# EasyEDA Pro project Simple打印机-V10.eprj

# Schematic Schematic4_6
Create Date: 2023-04-25; Page Name: P1; Project Name: Mini打印机-V8; Schematic Name: Schematic4_6; Update Date: 2023-09-03; Company: 嘉立创EDA; Page Size: A2; Version: V1.0
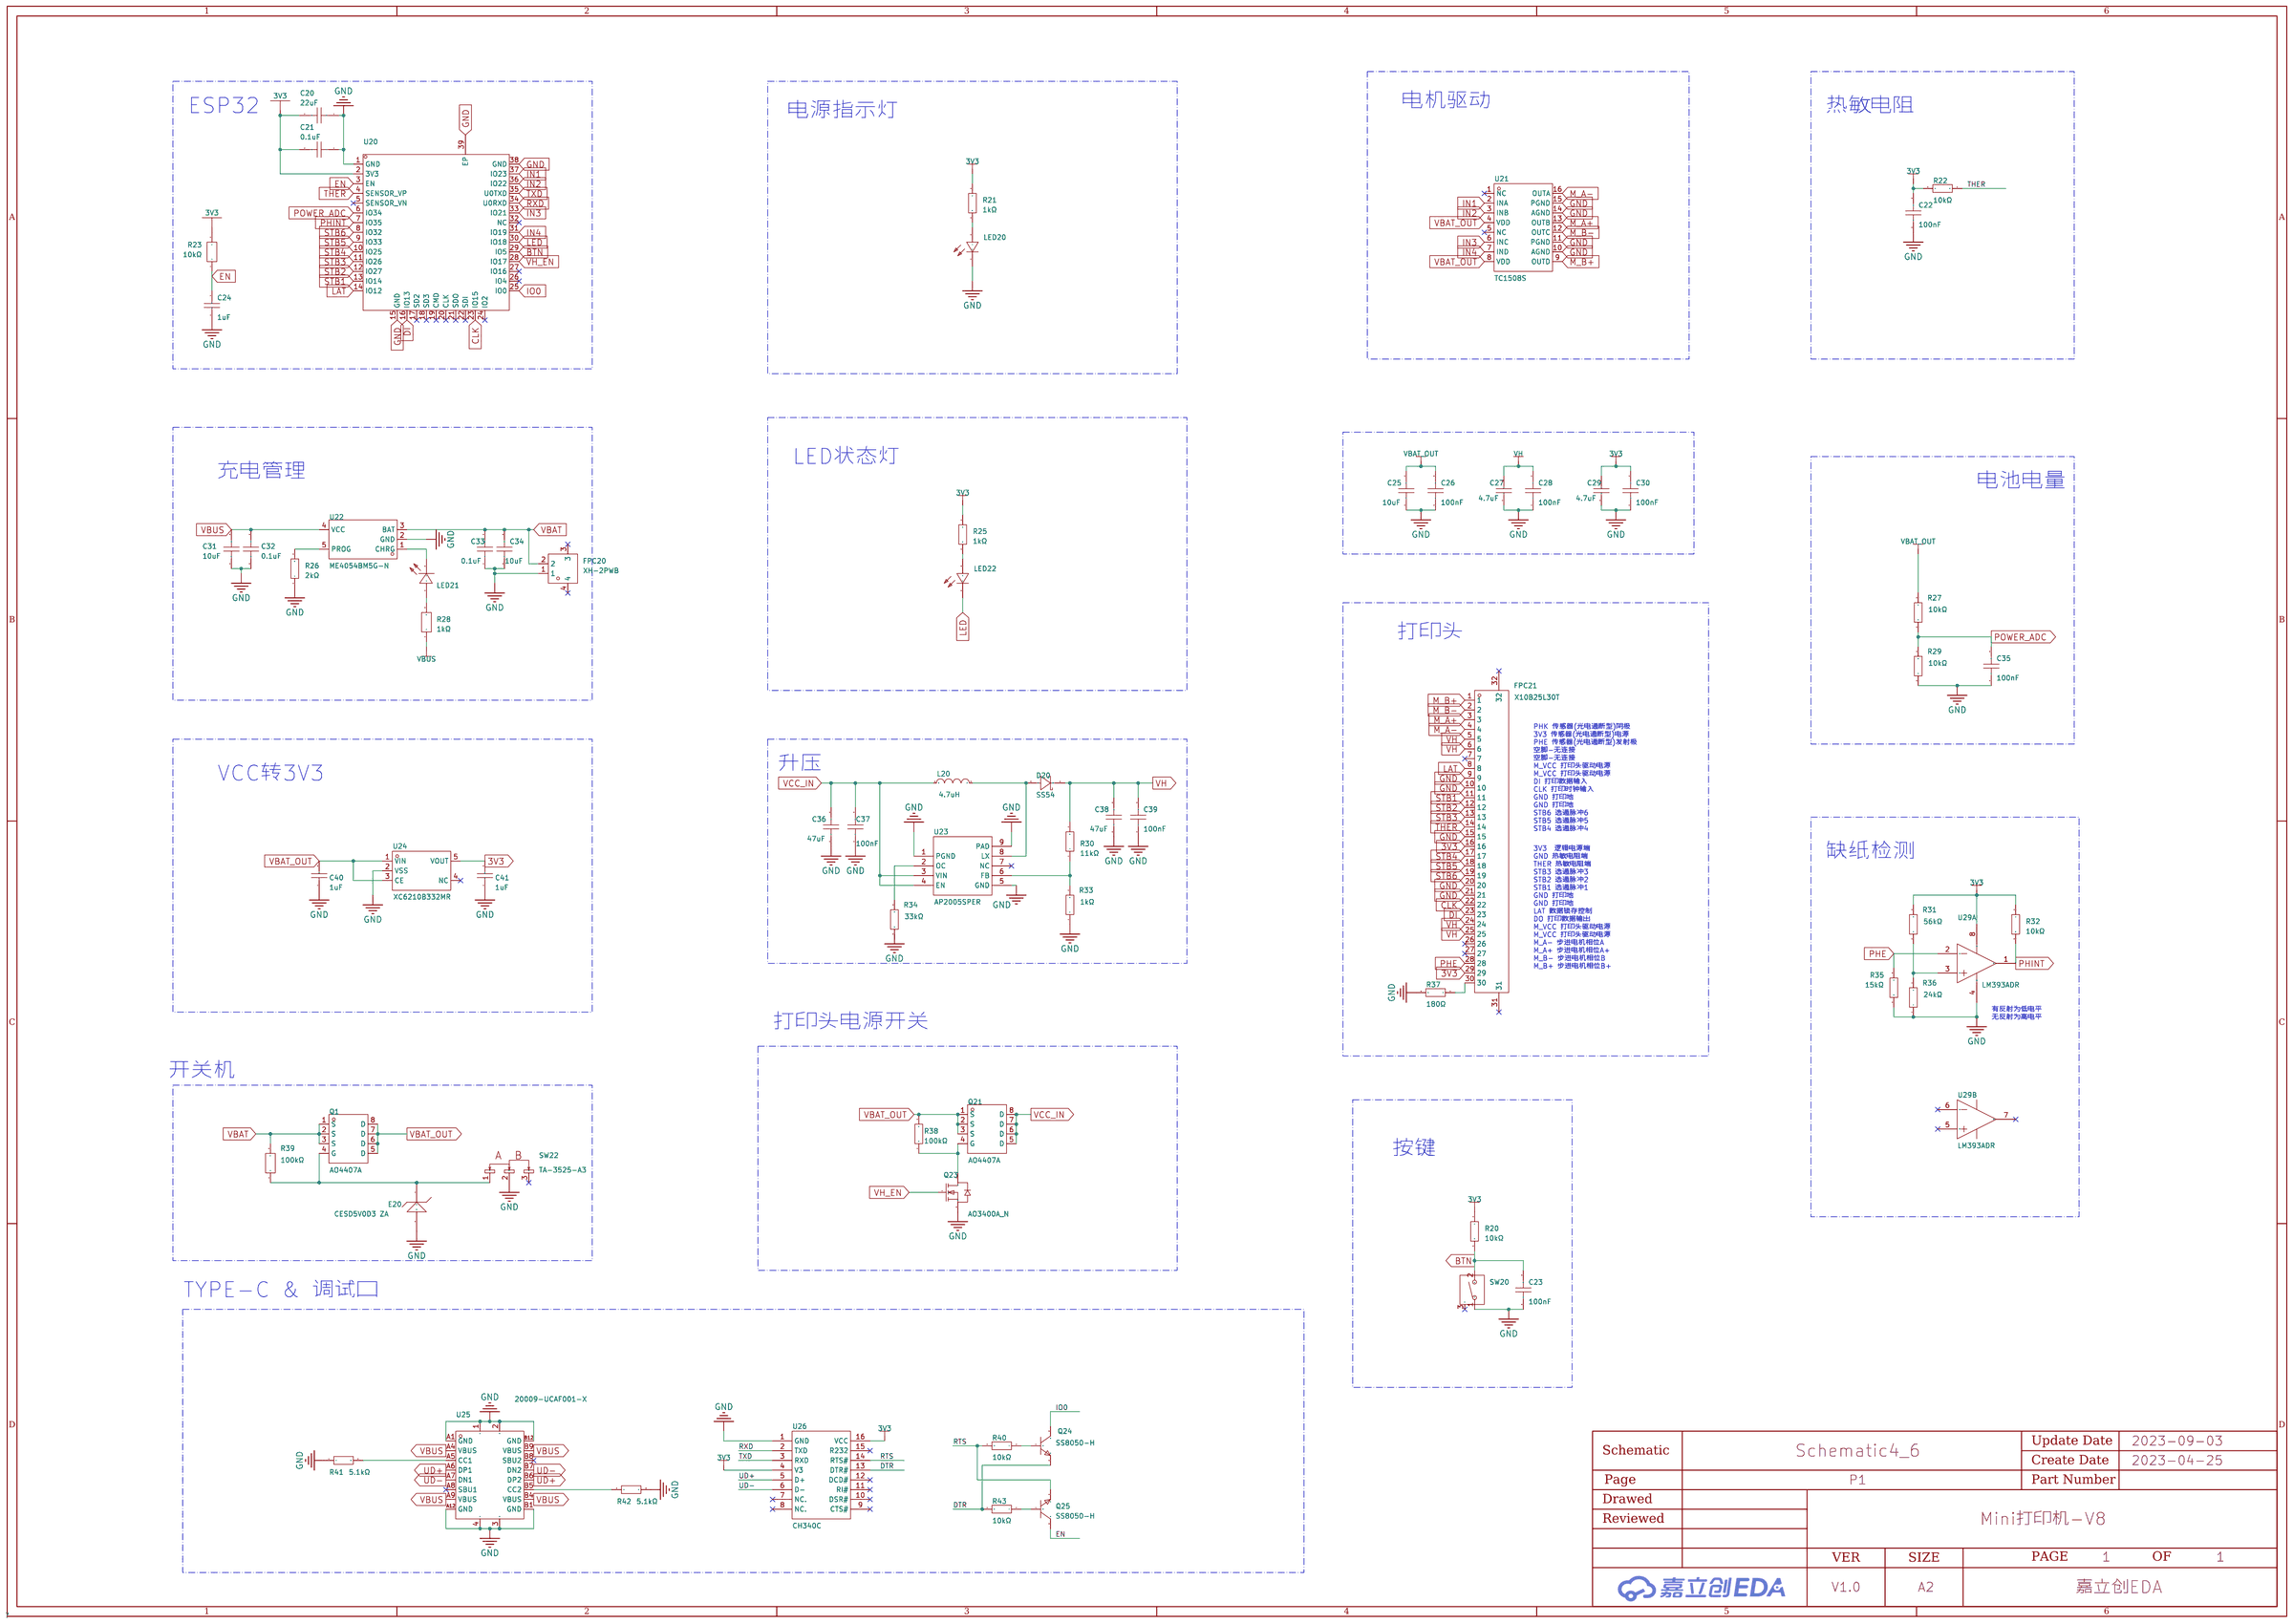
[diagram p0: schematic sheet]

## Parts
C20  22uF  [c0603]
C21  0.1uF  [c0603]
C22  100nF  [C0603]
C23  100nF  [C0603]
C24  1uF  [C0603]
C25  10uF  [C0603]
C26  100nF  [C0603]
C27  4.7uF  [C0603]
C28  100nF  [C0603]
C29  4.7uF  [C0603]
C30  100nF  [C0603]
C31  10uF  [C0603]
C32  0.1uF  [c0603]
C33  0.1uF  [c0603]
C34  10uF  [C0603]
C35  100nF  [C0603]
C36  47uF  [C1206]
C37  100nF  [C0603]
C38  47uF  [C1206]
C39  100nF  [C0603]
C40  1uF  [C0603]
C41  1uF  [C0603]
D20  SS54  [SMA_L4.3-W2.6-LS5.0-RD]
E20  CESD5V0D3 ZA  [SOD-323_L1.8-W1.3-LS2.5-RD]
FPC20  XH-2PWB  [CONN-SMD_2P-P2.50_DEALON_XH-2PWB_C2905024]
FPC21  X10B25L30T  [FPC-SMD_X10B25U30T]
L20  4.7uH  [IND-SMD_L6.0-W6.0]
LED20  NCD0603R1  [LED0603-RD_RED]
LED21  TLMG1100-GS08  [LED0603-R-RD_GREEN]
LED22  NCD0603R1  [LED0603-RD_RED]
Q1  AO4407A  [SOP-8_L5.0-W4.0-P1.27-LS6.0-BL]
Q21  AO4407A  [SOP-8_L5.0-W4.0-P1.27-LS6.0-BL]
Q23  AO3400A_N  [SOT-23-3_L2.9-W1.3-P1.90-LS2.4-BR]
Q24  SS8050-H  [SOT-23-3_L2.9-W1.3-P1.90-LS2.4-BR]
Q25  SS8050-H  [SOT-23-3_L2.9-W1.3-P1.90-LS2.4-BR]
R20  10kΩ  [R0603]
R21  1kΩ  [R0603]
R22  10kΩ  [R0603]
R23  10kΩ  [r0603]
R25  1kΩ  [R0603]
R26  2kΩ  [R0603]
R27  10kΩ  [R0603]
R28  1kΩ  [R0603]
R29  10kΩ  [R0603]
R30  11kΩ  [R0603]
R31  56kΩ  [R0603]
R32  10kΩ  [R0603]
R33  1kΩ  [R0603]
R34  33kΩ  [R0603]
R35  15kΩ  [R0603]
R36  24kΩ  [R0603]
R37  180Ω  [R0603]
R38  100kΩ  [R0603]
R39  100kΩ  [R0603]
R40  10kΩ  [R0603]
R41  5.1kΩ  [R0603]
R42  5.1kΩ  [R0603]
R43  10kΩ  [R0603]
SW20  TS4538B3JTP 250gf 121  [KEY-SMD_3P-L4.5-W3.8-P3.00-LS4.5-BL]
SW22  TA-3525-A3  [SW-SMD_3P-L9.1-W3.5-P2.50-EH6.8]
U20  -  [wirelm-smd_esp32-s]
U21  TC1508S  [SOP-16_L10.0-W3.9-P1.27-LS6.0-BL]
U22  ME4054BM5G-N  [TSOT-23-5_L2.9-W1.6-P0.95-LS2.8-BL]
U23  AP2005SPER  [ESOP-8_L4.9-W3.9-P1.27-LS6.0-BL-EP]
U24  XC6210B332MR  [TSOT-23-5_L2.9-W1.6-P0.95-LS2.8-BR]
U25  20009-UCAF001-X  [TYPE-C-SMD_20009-UCAF001-X]
U26  CH340C  [SOP-16_L10.0-W3.9-P1.27-LS6.0-BL]
U29  LM393ADR  [SOP-8_L4.9-W3.9-P1.27-LS6.0-BL]  (sections 1,2)

## Library data of the parts
C20 = mt18n1r5c500ct: 容值:22uF;精度:±0.25pF;额定电压:50V;温度系数:NP0;; LCSC Part Name: 22uF 25V; Supplier Part: C96446; Manufacturer: 华新科(Walsin); Manufacturer Part: MT18N1R5C500CT; Supplier Footprint: 0603; JLCPCB Part Class: Extended Part; Datasheet: https://atta.szlcsc.com/upload/public/pdf/source/20191217/C470045_C8EA1FED8E7D9FF06975A0CE3DEB0325.pdf; Supplier: LCSC; Tolerance: ±0.25pF; Voltage Rated: 50V; Temperature Coefficient: NP0
C21 C32 C33 = mt18n1r5c500ct: 容值：100nF 精度：±10% 额定电压：50V 材质(温度系数)：X7R 材质:X7R; LCSC Part Name: 100nF; Supplier Part: C14663; Manufacturer: 华新科(Walsin); Manufacturer Part: MT18N1R5C500CT; Supplier Footprint: 0603; JLCPCB Part Class: Extended Part; Datasheet: https://atta.szlcsc.com/upload/public/pdf/source/20191217/C470045_C8EA1FED8E7D9FF06975A0CE3DEB0325.pdf; Supplier: LCSC; Tolerance: ±0.25pF; Voltage Rated: 50V; Temperature Coefficient: NP0
C22 C23 C26 C28 C30 C35 C37 C39 = CL10B104KB8NNNC: 容值:100nF;精度:±10%;额定电压:50V;材质(温度系数):X7R;; LCSC Part Name: 100nF ±10% 50V; Supplier Part: C1591; Manufacturer: SAMSUNG(三星); Supplier Footprint: 0603; JLCPCB Part Class: 扩展库; Datasheet: https://atta.szlcsc.com/upload/public/pdf/source/20160103/1457707680512.pdf; Supplier: LCSC; Tolerance: ±10%; Voltage Rated: 50V; Temperature Coefficient: X7R
C24 C40 C41 = CL10A105KB8NNNC: 容值:1uF;精度:±10%;额定电压:50V;材质(温度系数):X5R;; LCSC Part Name: 1uF ±10% 50V; Supplier Part: C15849; Manufacturer: SAMSUNG(三星); Supplier Footprint: 0603; JLCPCB Part Class: 基础库; Datasheet: https://atta.szlcsc.com/upload/public/pdf/source/20160103/1457707679084.pdf; Supplier: LCSC; Tolerance: ±10%; Voltage Rated: 50V; Temperature Coefficient: X5R
C25 C31 C34 = CL10A106MA8NRNC: 容值:10uF;精度:±20%;额定电压:25V;材质(温度系数):X5R;; LCSC Part Name: 10uF ±20% 25V; Supplier Part: C96446; Manufacturer: SAMSUNG(三星); Supplier Footprint: 0603; JLCPCB Part Class: 基础库; Datasheet: https://atta.szlcsc.com/upload/public/pdf/source/20170325/1490427913016.pdf; Supplier: LCSC; Tolerance: ±20%; Voltage Rated: 25V; Temperature Coefficient: X5R
C27 C29 = CL10A475KA8NQNC: 容值:4.7uF;精度:±10%;额定电压:25V;材质(温度系数):X5R;; LCSC Part Name: 4.7uF ±10% 25V; Supplier Part: C69335; Manufacturer: SAMSUNG(三星); Supplier Footprint: 0603; JLCPCB Part Class: 扩展库; Datasheet: https://atta.szlcsc.com/upload/public/pdf/source/20161108/1478586410580.pdf; Supplier: LCSC; Tolerance: ±10%; Voltage Rated: 25V; Temperature Coefficient: X5R
C36 C38 = CL31A476MPHNNNE: 容值:47uF;精度:±20%;额定电压:10V;材质(温度系数):X5R;; LCSC Part Name: 47uF ±20% 10V; Supplier Part: C96123; Manufacturer: SAMSUNG(三星); Supplier Footprint: 1206; JLCPCB Part Class: 基础库; Datasheet: https://atta.szlcsc.com/upload/public/pdf/source/20170228/1488267692219.pdf; Supplier: LCSC; Tolerance: ±20%; Voltage Rated: 10V; Temperature Coefficient: X5R
D20 = SS54_C727065: 二极管配置:独立式;直流反向耐压(Vr):40V;平均整流电流(Io):5A;正向压降(Vf):550mV@5A;反向电流(Ir):500uA@40V;; LCSC Part Name: 40V 5A 550mV@5A; Supplier Part: C727065; Manufacturer: TWGMC(台湾迪嘉); Supplier Footprint: SMA; JLCPCB Part Class: 扩展库; Datasheet: https://atta.szlcsc.com/upload/public/pdf/source/20200828/C727064_BD0A2B36CBC76CEA4B6710C57718D41F.pdf; Supplier: LCSC; Diode Configuration: 独立式; Reverse Voltage (Vr): 40V; Average Rectified Current (Io): 5A; Forward Voltage (Vf@If): 550mV@5A; Reverse Leakage Current (Ir): 500uA@40V
E20 = CESD5V0D3 ZA: 极性:单向;反向截止电压(Vrwm):5V;击穿电压(VBR):6.2V;峰值脉冲电流(Ipp)@8/20us:15A;钳位电压(Vc)@Ipp:15.5V;; LCSC Part Name: CESD5V0D3  ZA; Supplier Part: C22643; Manufacturer: CJ(江苏长电/长晶); Supplier Footprint: SOD-323; JLCPCB Part Class: 扩展库; Datasheet: https://atta.szlcsc.com/upload/public/pdf/source/20140301/1457707004115.pdf; Supplier: LCSC; Polarity: 单向; Reverse Stand-Off Voltage (Vrwm): 5V; Breakdown Voltage (VBR): 6.2V; Peak Pulse Current(Ipp)@8/20us: 15A; Clamping Voltage@Ipp: 15.5V
FPC20 = XH-2PWB: 参考系列:XH;间距:2.5mm;插针结构:1x2P;排数:1;每排PIN数:2;行距:-;公母:公型插针;安装方式:卧贴;额定电流:3A;工作温度范围:-25~+85;; LCSC Part Name: XH 2.5mm 1x2P 卧贴; Supplier Part: C2905024; Manufacturer: DEALON(德艺隆); Supplier Footprint: SMD,P=2.5mm; JLCPCB Part Class: 扩展库; Datasheet: https://atta.szlcsc.com/upload/public/pdf/source/20211025/6C2B75DB1AEBD099C7E95723735B67A6.pdf; Supplier: LCSC; Reference Series: XH; Pitch: 2.5mm; Pins Structure: 1x2P; Number of Rows: 1; Number of PINs Per Row: 2; Gender: 公型插针; Mounting Style: 卧贴; Current Rating (Max): 3A; Operating Temperature Range: -25~+85
FPC21 = X10B25L30T: 间距:1mm;触点数量:30;锁定特性:抽屉式;安装类型:卧贴;触点类型:下接;工作温度范围:-40~+85;焊接温度(最大值):260;; LCSC Part Name: 1mm P数:30 抽屉式 下接 镀锡; Supplier Part: C500182; Manufacturer: XKB Connectivity(中国星坤); Supplier Footprint: SMD,P=1mm; JLCPCB Part Class: 扩展库; Datasheet: https://atta.szlcsc.com/upload/public/pdf/source/20211011/C16FFC4EB876FDA360008692BDE0DBBC.pdf; Supplier: LCSC; Pitch: 1mm; Number of Contacts: 30; Locking Feature: 抽屉式; Mounting Type: 卧贴; Contact Type: 下接; Height Above Board: 2.5mm; FFC, FCB Thickness: 0.3mm; Contact Material: 磷青铜; Contact Plating: 锡; Operating Temperature Range: -40~+85; Welding Temperature (Max): 260
L20 = 1255AY-4R7M=P3: 电感值:4.7uH;精度:±20%;额定电流:4A;直流电阻(DCR):27.6mΩ;; LCSC Part Name: 4.7uH ±20% 4A 27.6mΩ; Supplier Part: C160951; Manufacturer: muRata(村田); Supplier Footprint: SMD,6x6mm; JLCPCB Part Class: 扩展库; Datasheet: https://atta.szlcsc.com/upload/public/pdf/source/20180321/1B6FF4BE0FFC72AFEACC22219DD2DCA9.pdf; Supplier: LCSC; Tolerance: ±20%; Rated Current: 4A; DC Resistance (DCR): 27.6mΩ
LED20 LED22 = NCD0603R1_C84263: 发光颜色:红灯;; LCSC Part Name: 红灯; Supplier Part: C84263; Manufacturer: 国星光电; Supplier Footprint: 0603; JLCPCB Part Class: 扩展库; Datasheet: https://atta.szlcsc.com/upload/public/pdf/source/20200820/C84263_DABC6A75E58F576973B407FDBA283D60.pdf; Supplier: LCSC; Emitted Color: 红灯
LED21 = TLMG1100-GS08: 照明颜色:普绿/黄绿;色温 - CCT（K）:-;主波长/色坐标:570nm;; LCSC Part Name: 普绿/黄绿 0603; Supplier Part: C241891; Manufacturer: VISHAY(威世); Supplier Footprint: 0603; JLCPCB Part Class: 扩展库; Datasheet: https://atta.szlcsc.com/upload/public/pdf/source/20180719/C241891_3C76D4DD30CDE57601F75DEAAAECA69D.pdf; Supplier: LCSC; Mounting Type: 表面贴装; Illumination Color: 普绿/黄绿; Luminous Intensity (IF=20mA): 35mcd; Dominant Wavelength / Coordinate rank: 570nm
Q1 Q21 = AO4407A_C2841482: 类型:-;漏源电压(Vdss):-;连续漏极电流(Id):-;功率(Pd):-;导通电阻(RDS(on)@Vgs,Id):-;阈值电压(Vgs(th)@Id):-;栅极电荷(Qg@Vgs):-;输入电容(Ciss@Vds):-;反向传输电容(Crss@Vds):-;; Supplier Part: C2841482; Manufacturer: UMW(友台半导体); Supplier Footprint: SOP-8; JLCPCB Part Class: 扩展库; Datasheet: https://atta.szlcsc.com/upload/public/pdf/source/20220926/8EBB8ABDBC276CD6D410CF8B1BF429E7.pdf; Supplier: LCSC
Q23 = AO3400A_C347475: LCSC Part Name: AO3400A; Supplier Part: C347475; Manufacturer: UMW(友台半导体); Manufacturer Part: AO3400A; Supplier Footprint: SOT-23; JLCPCB Part Class: 扩展库; Datasheet: https://atta.szlcsc.com/upload/public/pdf/source/20190827/C347475_40CAF14D9CD0153436F5DC917B39143D.pdf; Supplier: LCSC
Q24 Q25 = SS8050-H: 晶体管类型:NPN;集射极击穿电压(Vceo):25V;集电极电流(Ic):1.5A;功率(Pd):300mW;集电极截止电流(Icbo):100nA;集电极-发射极饱和电压(VCE(sat)@Ic,Ib):500mV@800mA,80mA;直流电流增益(hFE@Ic,Vce):200@100mA,1V;特征频率(fT):100MHz;工作温度:-55~+150@(Tj);; LCSC Part Name: NPN 25V 1.5A; Supplier Part: C699255; Manufacturer: YANGJIE(扬杰); Supplier Footprint: SOT-23-3L; JLCPCB Part Class: 扩展库; Datasheet: https://atta.szlcsc.com/upload/public/pdf/source/20200709/C699255_98BD284548BE18129453A2CE3A1F2C22.pdf; Supplier: LCSC; Transistor Type: NPN; Collector-Emitter Breakdown Voltage (Vceo): 25V; Collector Current (Ic): 1.5A; Power Dissipation (Pd): 300mW; Collector Cut-Off Current (Icbo): 100nA; Collector-Emitter Saturation Voltage (VCE(sat)@Ic,Ib): 500mV@800mA,80mA; DC Current Gain (hFE@Ic,Vce): 200@100mA,1V; Transition Frequency (fT): 100MHz; Operating Temperature: -55~+150@(Tj)
R20 R40 R43 = ERJ3EKF1002V: 阻值:10kΩ;精度:±1%;功率:100mW;温度系数:±100ppm/;最大工作电压:-;工作温度范围:-55~+155;; LCSC Part Name: 10kΩ ±1%; Supplier Part: C191124; Manufacturer: PANASONIC(松下); Supplier Footprint: 0603; JLCPCB Part Class: 扩展库; Datasheet: https://atta.szlcsc.com/upload/public/pdf/source/20180502/C191124_A4CEFA964CCDF04BFD540D495CFFCAE0.pdf; Supplier: LCSC; Tolerance: ±1%; Power(Watts): 100mW; Temperature Coefficient: ±100ppm/; Operating Temperature Range: -55~+155
R21 R25 R33 = RMC06031K1%N: 阻值:1kΩ;精度:±1%;功率:100mW;; LCSC Part Name: 1kΩ ±1% 100mW; Supplier Part: C269704; Manufacturer: Tyohm(幸亚电阻); Supplier Footprint: 0603; JLCPCB Part Class: 扩展库; Datasheet: https://atta.szlcsc.com/upload/public/pdf/source/20190115/C269704_F6655FCC7D12D398136A4BB29A88B2DC.pdf; Supplier: LCSC; Tolerance: ±1%; Power(Watts): 100mW
R22 R27 R29 R32 = 0603WAF1002T5E: 电阻类型:厚膜电阻;阻值:10kΩ;精度:±1%;功率:100mW;温度系数:±100ppm/;最大工作电压:75V;工作温度范围:-55~+155;; LCSC Part Name: 10kΩ ±1% 100mW; Supplier Part: C25804; Manufacturer: UNI-ROYAL(厚声); Supplier Footprint: 0603; JLCPCB Part Class: 基础库; Datasheet: https://atta.szlcsc.com/upload/public/pdf/source/20200306/C422600_1E6D84923E4A46A82E41ADD87F860B5C.pdf; Supplier: LCSC; Type: 厚膜电阻; Tolerance: ±1%; Power(Watts): 100mW; Temperature Coefficient: ±100ppm/; Overload Voltage (Max): 75V; Operating Temperature Range: -55~+155
R23 = sg73p1jttd1002f: 阻值:10kΩ;精度:±1%;功率:-;温度系数:-;; LCSC Part Name: 10kΩ ±1%; Supplier Part: C880254; Manufacturer: KOA; Manufacturer Part: SG73P1JTTD1002F; Supplier Footprint: 0603; JLCPCB Part Class: Extended Part; Datasheet: https://atta.szlcsc.com/upload/public/pdf/source/20190109/C346159_A2BB9C83E7E727C8F8277542505B206B.pdf; Supplier: LCSC; Tolerance: ±1%
R26 = 0603WAF2001T5E: 精度:±1%;阻值:2kΩ;温度系数:±100ppm/;功率:1/10W;最大工作电压:75V;工作温度范围:-55~+155;; LCSC Part Name: 2KΩ ±1%; Supplier Part: C22975; Manufacturer: UNI-ROYAL(厚声); Supplier Footprint: 0603; JLCPCB Part Class: 基础库; Datasheet: https://atta.szlcsc.com/upload/public/pdf/source/20170920/C22975_1505901012894982362.pdf; Supplier: LCSC; Type: 厚膜电阻; Tolerance: ±1%; Power(Watts): 1/10W; Temperature Coefficient: ±100ppm/; Overload Voltage (Max): 75V; Operating Temperature Range: -55~+155
R28 = ERA3VEB1001V: 温度系数:±25ppm/K;温度系数:±25ppm/K;工作温度范围:-55~+155;工作温度范围:-55~+155;精度:±0.1%;最大工作电压:100V;类型:薄膜电阻;功率:125mW;阻值:1kΩ;; LCSC Part Name: 1KΩ(1001) ±0.1%; Supplier Part: C490794; Manufacturer: PANASONIC(松下); Supplier Footprint: 0603; Datasheet: https://atta.szlcsc.com/upload/public/pdf/source/20200407/C490794_144E786BD6B5906C11E86C00580B1EF5.pdf; Supplier: LCSC; Temperature Coefficient: ±25ppm/K; Operating Temperature Range: -55~+155; Tolerance: ±0.1%; Overload Voltage (Max): 100V; Type: 薄膜电阻; Power(Watts): 125mW
R30 = 0603WAJ0113T5E: 电阻类型:厚膜电阻;阻值:11kΩ;精度:±5%;功率:100mW;温度系数:±100ppm/;最大工作电压:75V;工作温度范围:-55~+155;; LCSC Part Name: 11kΩ ±5% 100mW; Supplier Part: C25983; Manufacturer: UNI-ROYAL(厚声); Supplier Footprint: 0603; JLCPCB Part Class: 扩展库; Datasheet: https://atta.szlcsc.com/upload/public/pdf/source/20200306/C422600_1E6D84923E4A46A82E41ADD87F860B5C.pdf; Supplier: LCSC; Type: 厚膜电阻; Tolerance: ±5%; Power(Watts): 100mW; Temperature Coefficient: ±100ppm/; Overload Voltage (Max): 75V; Operating Temperature Range: -55~+155
R31 = 0603WAF5602T5E: 电阻类型:厚膜电阻;阻值:56kΩ;精度:±1%;功率:100mW;温度系数:±100ppm/;最大工作电压:75V;工作温度范围:-55~+155;; LCSC Part Name: 56kΩ ±1% 100mW; Supplier Part: C23206; Manufacturer: UNI-ROYAL(厚声); Supplier Footprint: 0603; JLCPCB Part Class: 基础库; Datasheet: https://atta.szlcsc.com/upload/public/pdf/source/20200306/C422600_1E6D84923E4A46A82E41ADD87F860B5C.pdf; Supplier: LCSC; Type: 厚膜电阻; Tolerance: ±1%; Power(Watts): 100mW; Temperature Coefficient: ±100ppm/; Overload Voltage (Max): 75V; Operating Temperature Range: -55~+155
R34 = 0603WAF3302T5E: 电阻类型:厚膜电阻;阻值:33kΩ;精度:±1%;功率:100mW;温度系数:±100ppm/;最大工作电压:75V;工作温度范围:-55~+155;; LCSC Part Name: 33kΩ ±1% 100mW; Supplier Part: C4216; Manufacturer: UNI-ROYAL(厚声); Supplier Footprint: 0603; JLCPCB Part Class: 基础库; Datasheet: https://atta.szlcsc.com/upload/public/pdf/source/20200306/C422600_1E6D84923E4A46A82E41ADD87F860B5C.pdf; Supplier: LCSC; Type: 厚膜电阻; Tolerance: ±1%; Power(Watts): 100mW; Temperature Coefficient: ±100ppm/; Overload Voltage (Max): 75V; Operating Temperature Range: -55~+155
R35 = 0603WAF1502T5E: 电阻类型:厚膜电阻;阻值:15kΩ;精度:±1%;功率:100mW;温度系数:±100ppm/;最大工作电压:75V;工作温度范围:-55~+155;; LCSC Part Name: 15kΩ ±1% 100mW; Supplier Part: C22809; Manufacturer: UNI-ROYAL(厚声); Supplier Footprint: 0603; JLCPCB Part Class: 基础库; Datasheet: https://atta.szlcsc.com/upload/public/pdf/source/20200306/C422600_1E6D84923E4A46A82E41ADD87F860B5C.pdf; Supplier: LCSC; Type: 厚膜电阻; Tolerance: ±1%; Power(Watts): 100mW; Temperature Coefficient: ±100ppm/; Overload Voltage (Max): 75V; Operating Temperature Range: -55~+155
R36 = 0603WAF2402T5E: 电阻类型:厚膜电阻;阻值:24kΩ;精度:±1%;功率:100mW;温度系数:±100ppm/;最大工作电压:75V;工作温度范围:-55~+155;; LCSC Part Name: 24kΩ ±1% 100mW; Supplier Part: C23352; Manufacturer: UNI-ROYAL(厚声); Supplier Footprint: 0603; JLCPCB Part Class: 基础库; Datasheet: https://atta.szlcsc.com/upload/public/pdf/source/20200306/C422600_1E6D84923E4A46A82E41ADD87F860B5C.pdf; Supplier: LCSC; Type: 厚膜电阻; Tolerance: ±1%; Power(Watts): 100mW; Temperature Coefficient: ±100ppm/; Overload Voltage (Max): 75V; Operating Temperature Range: -55~+155
R37 = 0603WAF1800T5E: 电阻类型:厚膜电阻;阻值:180Ω;精度:±1%;功率:100mW;温度系数:±100ppm/;最大工作电压:75V;工作温度范围:-55~+155;; LCSC Part Name: 180Ω ±1% 100mW; Supplier Part: C22828; Manufacturer: UNI-ROYAL(厚声); Supplier Footprint: 0603; JLCPCB Part Class: 基础库; Datasheet: https://atta.szlcsc.com/upload/public/pdf/source/20200306/C422600_1E6D84923E4A46A82E41ADD87F860B5C.pdf; Supplier: LCSC; Type: 厚膜电阻; Tolerance: ±1%; Power(Watts): 100mW; Temperature Coefficient: ±100ppm/; Overload Voltage (Max): 75V; Operating Temperature Range: -55~+155
R38 = 0603WAF1003T5E: 电阻类型:厚膜电阻;阻值:100kΩ;精度:±1%;功率:100mW;温度系数:±100ppm/;最大工作电压:75V;工作温度范围:-55~+155;; LCSC Part Name: 100kΩ ±1% 100mW; Supplier Part: C25803; Manufacturer: UNI-ROYAL(厚声); Supplier Footprint: 0603; JLCPCB Part Class: 基础库; Datasheet: https://atta.szlcsc.com/upload/public/pdf/source/20200306/C422600_1E6D84923E4A46A82E41ADD87F860B5C.pdf; Supplier: LCSC; Type: 厚膜电阻; Tolerance: ±1%; Power(Watts): 100mW; Temperature Coefficient: ±100ppm/; Overload Voltage (Max): 75V; Operating Temperature Range: -55~+155
R39 = ERA3VEB1003V: 温度系数:±25ppm/K;温度系数:±25ppm/K;工作温度范围:-55~+155;工作温度范围:-55~+155;精度:±0.1%;最大工作电压:100V;类型:薄膜电阻;功率:125mW;阻值:100kΩ;; LCSC Part Name: 100KΩ(1003) ±0.1%; Supplier Part: C490798; Manufacturer: PANASONIC(松下); Supplier Footprint: 0603; Datasheet: https://atta.szlcsc.com/upload/public/pdf/source/20200407/C490798_08261913A826923429B8832CE4774997.pdf; Supplier: LCSC; Temperature Coefficient: ±25ppm/K; Operating Temperature Range: -55~+155; Tolerance: ±0.1%; Overload Voltage (Max): 100V; Type: 薄膜电阻; Power(Watts): 125mW
R41 R42 = 0603WAF5101T5E: 电阻类型:厚膜电阻;阻值:5.1kΩ;精度:±1%;功率:100mW;温度系数:±100ppm/;最大工作电压:75V;工作温度范围:-55~+155;; LCSC Part Name: 5.1kΩ ±1% 100mW; Supplier Part: C23186; Manufacturer: UNI-ROYAL(厚声); Supplier Footprint: 0603; JLCPCB Part Class: 基础库; Datasheet: https://atta.szlcsc.com/upload/public/pdf/source/20200306/C422600_1E6D84923E4A46A82E41ADD87F860B5C.pdf; Supplier: LCSC; Type: 厚膜电阻; Tolerance: ±1%; Power(Watts): 100mW; Temperature Coefficient: ±100ppm/; Overload Voltage (Max): 75V; Operating Temperature Range: -55~+155
SW20 = TS4538B3JTP 250gf 121: 触点电流:50mA;额定电压(DC):12V;绝缘电阻:100MΩ;电路结构:单刀单掷;安装方式:立贴;按钮形状:圆形按钮;按钮/盖帽颜色:黑色;作用力:250gf@±50gf;机械寿命:50000;工作温度:-20~+85;引脚样式:-;开关长度:4.5mm;开关宽度:4.5mm;开关高度:3.8mm;带支架:否;; LCSC Part Name: 轻触开关 4.5*4.5*3.8mm 250gf 边三脚侧插贴片 卧式; Supplier Part: C2906367; Manufacturer: SHOU HAN(首韩); Supplier Footprint: SMD; JLCPCB Part Class: 扩展库; Datasheet: https://atta.szlcsc.com/upload/public/pdf/source/20211019/CD02DA46ABCD6E05459BB66A2E36F770.pdf; Supplier: LCSC; Contact Current: 50mA; Voltage Rating (DC): 12V; Insulation Resistance: 100MΩ; Circuit: 单刀单掷; Mounting Style: 立贴; Actuator Style: 圆形按钮; Actuator/Cap Color: 黑色; Operating Force: 250gf@±50gf; Mechanical Life: 50000; Operating Temperature: -20~+85; Switch Length: 4.5mm; Switch Width: 4.5mm; Switch Height: 3.8mm; Strike Gundam: 否
SW22 = TA-3525-A3: LCSC Part Name: 滑动开关9.1*3.5*4.0mm贴片侧拨单排三脚二档; Supplier Part: C514020; Manufacturer: Yuandi(元迪); Supplier Footprint: SMD,9.1x3.5mm; JLCPCB Part Class: 扩展库; Datasheet: https://atta.szlcsc.com/upload/public/pdf/source/20200415/C514019_BD29F4555739DB2630A1255040CB70C0.pdf; Supplier: LCSC
U20 = esp32-s: LCSC Part Name: ESP32-S; Supplier Part: C277944; Manufacturer: Ai-Thinker(安信可); Manufacturer Part: ESP32-S; Supplier Footprint: SMD Module; JLCPCB Part Class: Extended Part; Datasheet: https://atta.szlcsc.com/upload/public/pdf/source/20211217/F4BEA33E732D6002D10DAED85BBCB52B.pdf; Supplier: LCSC
U21 = TC1508S: 双通道直流马达驱动器; Supplier Part: C89480; Manufacturer: FM富满; Supplier Footprint: SOP-16_150mil; JLCPCB Part Class: 扩展库; Datasheet: https://atta.szlcsc.com/upload/public/pdf/watermark/20190926/C89480_A6157361397A766884EA63034F568297.pdf; Supplier: LCSC
U22 = ME4054BM5G-N: Supplier Part: C478383; Manufacturer: MICRONE(南京微盟); Supplier Footprint: TSOT-23-5; JLCPCB Part Class: 扩展库; Datasheet: https://atta.szlcsc.com/upload/public/pdf/source/20191226/C478383_334A5ED125CA9F8F85F7DE0AC0ECFE6D.pdf; Supplier: LCSC
U23 = AP2005SPER: 功能类型:升压型;同步整流:否;输出通道数:1;拓扑结构:升压式;输入电压:2.5V~5.5V;输出电压:9V;输出电流(最大值):-;开关频率:1MHz;; LCSC Part Name: 升压型 Vin=2.5V~5.5V Vout=9V; Supplier Part: C130340; Manufacturer: chipown(芯朋微电子); Supplier Footprint: SOP-8-EP-150mil; JLCPCB Part Class: 扩展库; Datasheet: https://atta.szlcsc.com/upload/public/pdf/source/20170918/C130340_1505703385511975250.pdf; Supplier: LCSC; Function: 升压型; Synchronous Rectification: 否; Number of Outputs: 1; Topology: 升压式; Input Voltage: 2.5V~5.5V; Output Voltage: 9V; Switching Frequency: 1MHz
U24 = XC6210B332MR_C424705: 输出类型:固定;输出极性:正;输出通道数:1;最大输入电压:6V;输出电压:3.3V;压差:75mV@(100mA);输出电流:900mA;电源纹波抑制比(PSRR):60dB@(1kHz);; LCSC Part Name: 正 Vin=6V Vout=3.3V 900mA 60dB@(1kHz); Supplier Part: C424705; Manufacturer: TOREX(特瑞仕); Supplier Footprint: SOT-25; JLCPCB Part Class: 扩展库; Datasheet: https://atta.szlcsc.com/upload/public/pdf/source/20190903/C424705_1DFB2113A9A78D399905DBF688657204.pdf; Supplier: LCSC; Output Type: 固定; Output Polarity: 正; Number of Outputs: 1; Maximum Input Voltage: 6V; Output Voltage: 3.3V; Dropout Voltage: 75mV@(100mA); Output Current: 900mA; Power Supply Rejection Ratio (PSRR): 60dB@(1kHz)
U25 = 20009-UCAF001-X: LCSC Part Name: TYPE C; Supplier Part: C3148200; Manufacturer: MINTRON(明硕); Supplier Footprint: SMD; JLCPCB Part Class: 扩展库; Datasheet: https://atta.szlcsc.com/upload/public/pdf/source/20220705/4C04992B6F70FB490BC74B4779796E6C.pdf; Supplier: LCSC
U26 = CH340C: 类型:Transceiver;协议类别:USB 2.0;驱动器/接收器数:-;数据速率:2Mbps;; Supplier Part: C84681; Manufacturer: WCH(南京沁恒); Supplier Footprint: SOP-16_150mil; JLCPCB Part Class: 扩展库; Datasheet: https://atta.szlcsc.com/upload/public/pdf/source/20200819/C84681_ADBED554CE321879DBD6B1D06488689C.pdf; Supplier: LCSC; Type: Transceiver; Protocol: USB 2.0; Data Rate: 2Mbps; Supply Voltage: 3.3V, 5V
U29 = LM393ADR: Supplier Part: C404321; Manufacturer: UMW(广东友台半导体); Supplier Footprint: SOP-8; JLCPCB Part Class: 扩展库; Datasheet: https://atta.szlcsc.com/upload/public/pdf/source/20190717/C404321_A4ABD44840A6EA97E1B271387656EEAD.pdf; Supplier: LCSC

## Nets
3V3: C20.2 C21.2 C22.2 C29.2 C30.2 C41.2 FPC21.16 FPC21.29 R20.1 R21.1 R22.2 R23.2 R25.1 R31.2 R32.1 U20.2(3V3) U24.5(VOUT) U26.4(V3) U26.16(VCC) U29.8(VCC)
GND: C20.1 C21.1 C22.1 C23.1 C24.1 C25.1 C26.1 C27.1 C28.1 C29.1 C30.1 C31.1 C32.2 C33.1 C34.1 C35.1 C36.1 C37.1 C38.1 C39.1 C40.1 C41.1 E20.2 FPC20.1 FPC21.9 FPC21.10 FPC21.15 FPC21.20 FPC21.21 LED20.1(K) Q23.2(S) R26.1 R29.1 R33.1 R34.1 R35.1 R36.1 R37.2 R41.1 R42.2 SW20.1 SW22.2 U20.1(GND) U20.15(GND) U20.38(GND) U20.39(EP) U21.10(AGND) U21.11(PGND) U21.14(AGND) U21.15(PGND) U22.2(GND) U23.1(PGND) U23.5(GND) U23.9(PAD) U24.2(VSS) U25.1 U25.2 U25.3 U25.4 U25.A1(GND) U25.A12(GND) U25.B1(GND) U25.B12(GND) U26.1(GND) U29.4(GND)
VBAT: C33.2 C34.2 FPC20.2 Q1.1(S) Q1.2(S) Q1.3(S) R39.2 U22.3(BAT)
VBAT_OUT: C25.2 C26.2 C40.2 Q1.5(D) Q1.6(D) Q1.7(D) Q1.8(D) Q21.1(S) Q21.2(S) Q21.3(S) R27.2 R38.2 U21.4(VDD) U21.8(VDD) U24.1(VIN) U24.3(CE)
VBUS: C31.2 C32.1 R28.1 U22.4(VCC) U25.A4(VBUS) U25.A9(VBUS) U25.B4(VBUS) U25.B9(VBUS)
VCC_IN: C36.2 C37.2 L20.1 Q21.5(D) Q21.6(D) Q21.7(D) Q21.8(D) U23.3(VIN) U23.4(EN)
BTN: C23.2 R20.2 SW20.2 U20.29(IO5)
CLK: FPC21.22 U20.23(IO15)
DI: FPC21.23 U20.16(IO13)
DTR: Q24.2(E) R43.2 U26.13(DTR#)
EN: C24.2 Q25.3(C) R23.1 U20.3(EN)
IN1: U20.37(IO23) U21.2(INA)
IN2: U20.36(IO22) U21.3(INB)
IN3: U20.33(IO21) U21.6(INC)
IN4: U20.31(IO19) U21.7(IND)
IO0: Q24.3(C) U20.25(IO0)
LAT: FPC21.8 U20.14(IO12)
LED: LED22.1(K) U20.30(IO18)
M_A+: FPC21.3 U21.13(OUTB)
M_A-: FPC21.4 U21.16(OUTA)
M_B+: FPC21.1 U21.9(OUTD)
M_B-: FPC21.2 U21.12(OUTC)
PHE: FPC21.28 R35.2 U29.2(INA-)
PHINT: R32.2 U20.7(IO35) U29.1(OUTA)
POWER_ADC: C35.2 R27.1 R29.2 U20.6(IO34)
RTS: Q25.2(E) R40.2 U26.14(RTS#)
RXD: U20.34(U0RXD) U26.2(TXD)
STB1: FPC21.11 U20.13(IO14)
STB2: FPC21.12 U20.12(IO27)
STB3: FPC21.13 U20.11(IO26)
STB4: FPC21.17 U20.10(IO25)
STB5: FPC21.18 U20.9(IO33)
STB6: FPC21.19 U20.8(IO32)
THER: FPC21.14 R22.1 U20.4(SENSOR_VP)
TXD: U20.35(U0TXD) U26.3(RXD)
UD+: U25.A6(DP1) U25.B6(DP2) U26.5(D+)
UD-: U25.A7(DN1) U25.B7(DN2) U26.6(D-)
VH: C27.2 C28.2 C38.2 C39.2 D20.1 FPC21.5 FPC21.6 FPC21.24 FPC21.25 R30.2
VH_EN: Q23.1(G) U20.28(IO17)
$1N47791: R31.1 R36.2 U29.3(INA+)
$1N163268: FPC21.30 R37.1
$1N171056: LED20.2(A) R21.2
$1N192885: Q25.1(B) R43.1
$1N192889: Q24.1(B) R40.1
$1N228514: Q21.4(G) Q23.3(D) R38.1
$1N228520: R30.1 R33.2 U23.6(FB)
$1N228523: R34.2 U23.2(OC)
$1N228526: D20.2 L20.2 U23.8(LX)
$1N229607: R26.2 U22.5(PROG)
$1N229610: LED21.1(A) R28.2
$1N229612: LED21.2(K) U22.1(CHRG)
$1N230614: R41.2 U25.A5(CC1)
$1N230615: R42.1 U25.B5(CC2)
$1N231307: LED22.2(A) R25.2
$1N232666: E20.1 Q1.4(G) R39.1 SW22.1

Not connected (* = marked no-connect by the designer): FPC20 3* 4*; FPC21 7* 26* 27* 31* 32*; SW20 3(EP)*; SW22 3*; U20 5(SENSOR_VN)* 17(SD2)* 18(SD3)* 19(CMD)* 20(CLK)* 21(SDO)* 22(SDI)* 24(IO2)* 26(IO4)* 27(IO16)* 32(NC)*; U21 1(NC)* 5(NC)*; U23 7(NC)*; U24 4(NC)*; U25 A8(SBU1)* B8(SBU2)*; U26 7(NC.)* 8(NC.)* 9(CTS#)* 10(DSR#)* 11(RI#)* 12(DCD#)* 15(R232)*; U29 5(INB+)* 6(INB-)* 7(OUTB)*

## Notes on the sheet
- 电机驱动
- ESP32
- 电源指示灯
- 热敏电阻
- LED状态灯
- 充电管理
- 电池电量
- 打印头
- PHK 传感器(光电通断型)阴极
  3V3 传感器(光电通断型)电源
  PHE 传感器(光电通断型)发射极
  空脚-无连接
  空脚-无连接
  M_VCC 打印头驱动电源
  M_VCC 打印头驱动电源
  DI 打印数据输入
  CLK 打印时钟输入
  GND 打印地
  GND 打印地
  STB6 选通脉冲6
  STB5 选通脉冲5
  STB4 选通脉冲4
- 升压
- VCC转3V3
- 3V3  逻辑电源端
  GND 热敏电阻端
  THER 热敏电阻端
  STB3 选通脉冲3
  STB2 选通脉冲2
  STB1 选通脉冲1
  GND 打印地
  GND 打印地
  LAT 数据锁存控制
  DO 打印数据输出
  M_VCC 打印头驱动电源
  M_VCC 打印头驱动电源
  M_A- 步进电机相位A
  M_A+ 步进电机相位A+
  M_B- 步进电机相位B
  M_B+ 步进电机相位B+
- 缺纸检测
- 有反射为低电平
  无反射为高电平
- 打印头电源开关
- 开关机
- 按键
- TYPE-C & 调试口

# Board PCB4_6
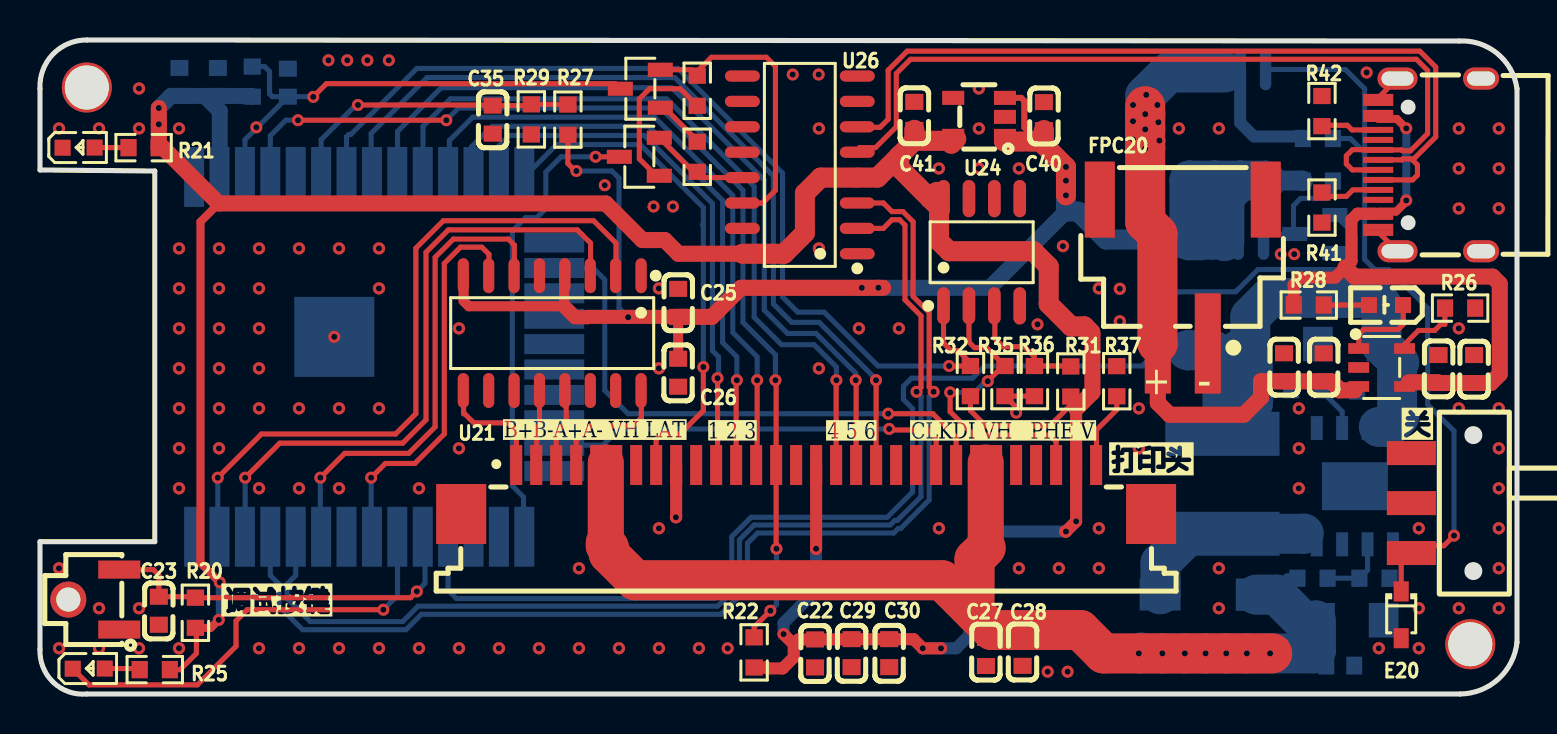
[diagram p1: board, top side]
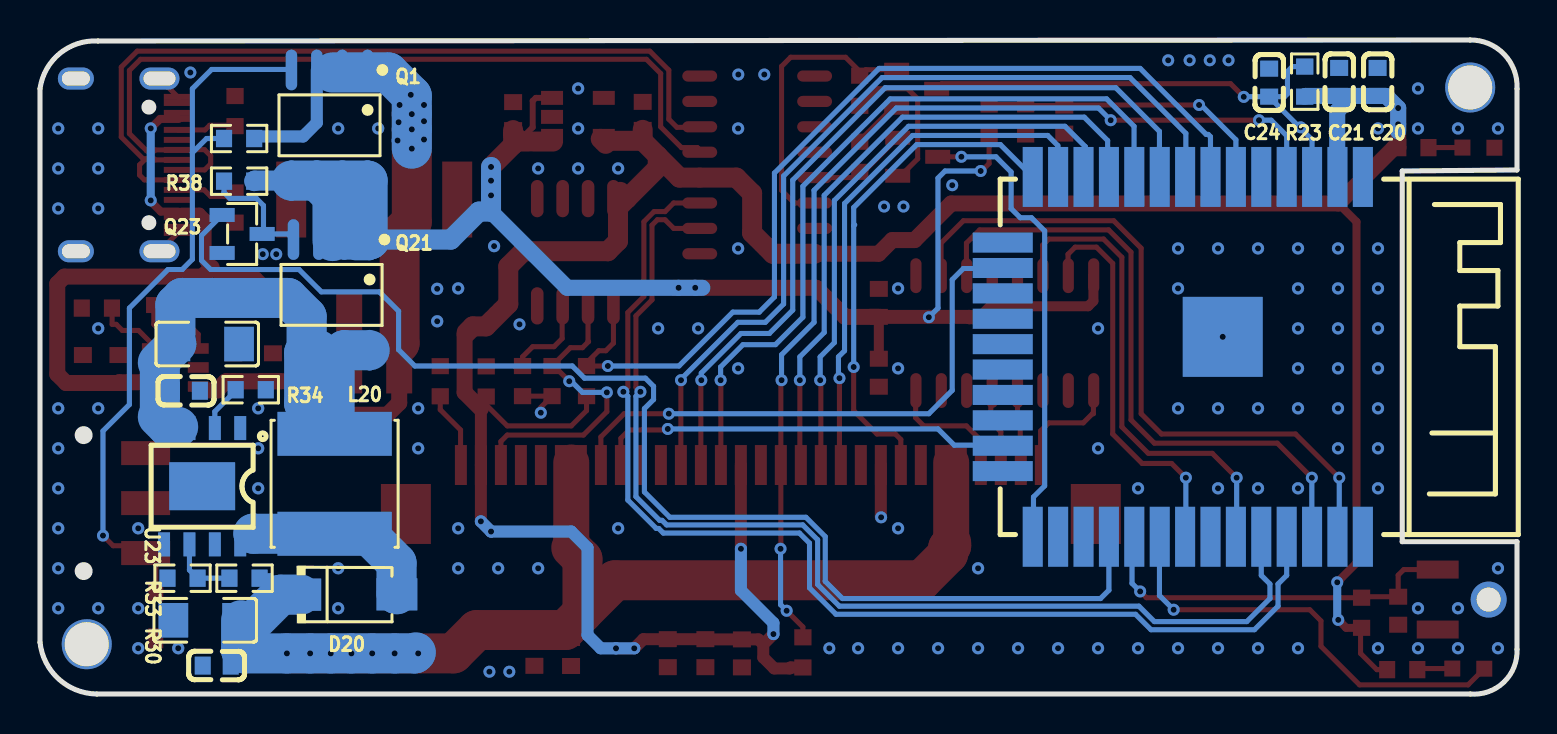
[diagram p2: board, bottom side, seen from below]

Outline 73.86 x 32.72 mm; copper layers: Top Layer, Bottom Layer. Coordinates in mm from the lower left corner of the outline.
Outline path: 0,30.28 0,26.21 5.74,26.16 5.74,7.62 0,7.62 0,2.24 arc(0.66,0.59) 2.34,0 71.02,0 arc(72.93,0.75) 73.86,2.59 73.86,30.28 arc(72.88,32.04) 70.97,32.66 2.35,32.72 arc(0.65,32) 0,30.28
Stack: Top Layer 0.035mm / Dielectric1 1.51mm FR4 er 4.5 / Bottom Layer 0.035mm

## Design rules (mm)
net UD+: DP1
net UD-: DP1
spacing safeClearance (default): track to track 0.127, other pairs 0.152 to 0.3
track width trackWidth (default): min 0.127, default 0.254, max 2.54
differential pair differentialPair (default): width min 0.127, default 0.254, max 2.54; gap min 0.152, default 0.152
via viaSize (default): diameter min 0.5, default 0.61, max 10; hole min 0.3, default 0.305, max 6

## Placement (name value [footprint] x y rotation side)
C20  22uF  [c0603]  6.97 30.62 270 bottom
C21  0.1uF  [c0603]  8.9 30.62 270 bottom
C22  100nF  [C0603]  38.76 2.03 90 top
C23  100nF  [C0603]  5.94 4.17 90 top
C24  1uF  [C0603]  12.39 30.58 270 bottom
C25  10uF  [C0603]  31.91 19.57 270 top
C26  100nF  [C0603]  31.91 16.07 90 top
C27  4.7uF  [C0603]  47.31 2.1 90 top
C28  100nF  [C0603]  49.14 2.11 90 top
C29  4.7uF  [C0603]  40.59 2.04 90 top
C30  100nF  [C0603]  42.47 2.04 90 top
C31  10uF  [C0603]  69.94 16.26 270 top
C32  0.1uF  [c0603]  71.72 16.26 90 top
C33  0.1uF  [c0603]  64.19 16.34 270 top
C34  10uF  [C0603]  62.21 16.34 270 top
C35  100nF  [C0603]  22.64 28.73 90 top
C36  47uF  [C1206]  65.5 17.51 0 bottom
C37  100nF  [C0603]  66.57 15.17 0 bottom
C38  47uF  [C1206]  65.6 3.69 180 bottom
C39  100nF  [C0603]  65.02 1.42 180 bottom
C40  1uF  [C0603]  50.2 28.91 270 top
C41  1uF  [C0603]  43.72 28.92 270 top
D20  SS54  [SMA_L4.3-W2.6-LS5.0-RD]  58.42 4.98 180 bottom
E20  CESD5V0D3 ZA  [SOD-323_L1.8-W1.3-LS2.5-RD]  68.07 3.96 270 top
FPC20  XH-2PWB  [CONN-SMD_2P-P2.50_DEALON_XH-2PWB_C2905024]  57.15 21.13 180 top
FPC21  X10B25L30T  [FPC-SMD_X10B25U30T]  38.31 10.23 0 top
L20  4.7uH  [IND-SMD_L6.0-W6.0]  59.13 10.52 270 bottom
LED20  NCD0603R1  [LED0603-RD_RED]  1.93 27.33 0 top
LED21  TLMG1100-GS08  [LED0603-R-RD_GREEN]  67.31 19.46 180 top
LED22  NCD0603R1  [LED0603-RD_RED]  2.44 1.27 0 top
NOREF  -  [Pad_e104]  2.34 30.34 0 top
NOREF#2  -  [Pad_e221]  71.53 2.49 0 top
Q1  AO4407A  [SOP-8_L5.0-W4.0-P1.27-LS6.0-BL]  59.38 28.45 0 bottom
Q21  AO4407A  [SOP-8_L5.0-W4.0-P1.27-LS6.0-BL]  59.28 19.96 0 bottom
Q23  AO3400A_N  [SOT-23-3_L2.9-W1.3-P1.90-LS2.4-BR]  63.75 23.01 0 bottom
Q24  SS8050-H  [SOT-23-3_L2.9-W1.3-P1.90-LS2.4-BR]  29.97 26.87 0 top
Q25  SS8050-H  [SOT-23-3_L2.9-W1.3-P1.90-LS2.4-BR]  30.02 30.28 0 top
R20  10kΩ  [R0603]  7.77 4.06 90 top
R21  1kΩ  [R0603]  5.18 27.33 180 top
R22  10kΩ  [R0603]  35.71 2.08 270 top
R23  10kΩ  [r0603]  10.62 30.63 270 bottom
R25  1kΩ  [R0603]  5.74 1.22 180 top
R26  2kΩ  [R0603]  71.02 19.3 180 top
R27  10kΩ  [R0603]  26.4 28.73 270 top
R28  1kΩ  [R0603]  63.45 19.46 0 top
R29  10kΩ  [R0603]  24.57 28.74 90 top
R30  11kΩ  [R0603]  63.64 5.79 180 bottom
R31  56kΩ  [R0603]  51.55 15.63 270 top
R32  10kΩ  [R0603]  46.53 15.65 90 top
R33  1kΩ  [R0603]  66.73 5.79 180 bottom
R34  33kΩ  [R0603]  63.32 15.22 0 bottom
R35  15kΩ  [R0603]  48.26 15.65 90 top
R36  24kΩ  [R0603]  49.73 15.65 90 top
R37  180Ω  [R0603]  53.85 15.65 90 top
R38  100kΩ  [R0603]  63.91 25.65 180 bottom
R39  100kΩ  [R0603]  63.91 27.79 180 bottom
R40  10kΩ  [R0603]  32.87 30.18 90 top
R41  5.1kΩ  [R0603]  64.11 24.33 90 top
R42  5.1kΩ  [R0603]  64.11 29.16 90 top
R43  10kΩ  [R0603]  32.87 26.87 270 top
SW20  TS4538B3JTP 250gf 121  [KEY-SMD_3P-L4.5-W3.8-P3.00-LS4.5-BL]  2.69 4.72 90 top
SW22  TA-3525-A3  [SW-SMD_3P-L9.1-W3.5-P2.50-EH6.8]  68.58 9.55 90 top
U20  -  [wirelm-smd_esp32-s]  16.71 16.87 270 bottom
U21  TC1508S  [SOP-16_L10.0-W3.9-P1.27-LS6.0-BL]  25.61 18.05 180 top
U22  ME4054BM5G-N  [TSOT-23-5_L2.9-W1.6-P0.95-LS2.8-BL]  67.1 16.33 270 top
U23  AP2005SPER  [ESOP-8_L4.9-W3.9-P1.27-LS6.0-BL-EP]  65.75 10.39 0 bottom
U24  XC6210B332MR  [TSOT-23-5_L2.9-W1.6-P0.95-LS2.8-BR]  46.96 28.87 0 top
U25  20009-UCAF001-X  [TYPE-C-SMD_20009-UCAF001-X]  69.49 26.47 90 top
U26  CH340C  [SOP-16_L10.0-W3.9-P1.27-LS6.0-BL]  38 26.47 90 top
U29  LM393ADR  [SOP-8_L4.9-W3.9-P1.27-LS6.0-BL]  47.09 22.1 0 top

## Footprints (pads in the part's own frame, mm; a bottom-side part is the same pattern mirrored in y, then rotated)
C0603
  rect 0.8x0.9 smd: 1(-0.7,0) 2(0.7,0)
c0603
  rect 0.8x0.9 smd: 1(-0.7,0) 2(0.7,0)
C1206
  rect 1.485x1.728 smd: 1(-1.593,0) 2(1.593,0)
CONN-SMD_2P-P2.50_DEALON_XH-2PWB_C2905024
  rect 1.3x5 smd: 1(-1.25,3.6) 2(1.25,3.6)
  rect 1.5x3.8 smd: 3(-4.15,-3.6) 4(4.15,-3.6)
ESOP-8_L4.9-W3.9-P1.27-LS6.0-BL-EP
  rect 0.6x1.2 smd: 1(-1.905,-2.909) 2(-0.635,-2.909) 3(0.635,-2.909) 4(1.905,-2.909) 5(1.905,2.909) 6(0.635,2.909) 7(-0.635,2.909) 8(-1.905,2.909)
  rect 3.3x2.4 smd: 9(0,0)
FPC-SMD_X10B25U30T
  rect 0.6x2 smd: 1(-14.5,1.225) 2(-13.5,1.225) 3(-12.5,1.225) 4(-11.5,1.225) 5(-10.5,1.225) 6(-9.5,1.225) 7(-8.5,1.225) 8(-7.5,1.225) 9(-6.5,1.225) 10(-5.5,1.225) 11(-4.5,1.225) 12(-3.5,1.225) 13(-2.5,1.225) 14(-1.5,1.225) 15(-0.5,1.225) 16(0.5,1.225) 17(1.5,1.225) 18(2.5,1.225) 19(3.5,1.225) 20(4.5,1.225) 21(5.5,1.225) 22(6.5,1.225) 23(7.5,1.225) 24(8.5,1.225) 25(9.5,1.225) 26(10.5,1.225) 27(11.5,1.225) 28(12.5,1.225) 29(13.5,1.225) 30(14.5,1.225)
  rect 2.5x3 smd: 31(17.25,-1.225) 32(-17.25,-1.225)
IND-SMD_L6.0-W6.0
  rect 2.2x5.72 smd: 1(-2.5,0) 2(2.5,0)
KEY-SMD_3P-L4.5-W3.8-P3.00-LS4.5-BL
  rect 0.9x2.1 smd: 1(-1.5,-1.274) 2(1.5,-1.274)
  round 1.8 hole 1.2: 3(0,1.274)
LED0603-R-RD_GREEN
  rect 0.8x0.8 smd: 1(0.851,0) 2(-0.851,0)
LED0603-RD_RED
  rect 0.8x0.8 smd: 1(-0.799,-0.004) 2(0.799,0.004)
Pad_e104
  round 2.5 hole 2.2: 25(0,0)
Pad_e221
  round 2.5 hole 2.2: 23(0,0)
R0603
  rect 0.806x0.864 smd: 1(-0.753,0) 2(0.753,0)
r0603
  rect 0.806x0.864 smd: 1(-0.753,0) 2(0.753,0)
SMA_L4.3-W2.6-LS5.0-RD
  rect 2.046x1.62 smd: 1(-2.404,-0.009) 2(2.404,0.009)
SOD-323_L1.8-W1.3-LS2.5-RD
  rect 1x0.75 smd: 1(-1.173,0) 2(1.173,0)
SOP-8_L4.9-W3.9-P1.27-LS6.0-BL
  oval 0.63x1.865 smd: 1(-1.905,-2.683) 2(-0.635,-2.683) 3(0.635,-2.683) 4(1.905,-2.683) 5(1.905,2.683) 6(0.635,2.683) 7(-0.635,2.683) 8(-1.905,2.683)
SOP-8_L5.0-W4.0-P1.27-LS6.0-BL
  oval 0.574x2.035 smd: 1(-1.905,-2.768) 2(-0.635,-2.768) 3(0.635,-2.768) 4(1.905,-2.768) 5(1.905,2.768) 6(0.635,2.768) 7(-0.635,2.768) 8(-1.905,2.768)
SOP-16_L10.0-W3.9-P1.27-LS6.0-BL
  oval 0.56x1.745 smd: 1(-4.445,-2.873) 2(-3.175,-2.873) 3(-1.905,-2.873) 4(-0.635,-2.873) 5(0.635,-2.873) 6(1.905,-2.873) 7(3.175,-2.873) 8(4.445,-2.873) 9(4.445,2.873) 10(3.175,2.873) 11(1.905,2.873) 12(0.635,2.873) 13(-0.635,2.873) 14(-1.905,2.873) 15(-3.175,2.873) 16(-4.445,2.873)
SOT-23-3_L2.9-W1.3-P1.90-LS2.4-BR
  rect 1.25x0.7 smd: 1(1,-0.95) 2(1,0.95) 3(-1,0)
SW-SMD_3P-L9.1-W3.5-P2.50-EH6.8
  rect 1.2x2.45 smd: 1(-2.5,0) 2(0,0) 3(2.5,0)
TSOT-23-5_L2.9-W1.6-P0.95-LS2.8-BL
  rect 0.532x1.045 smd: 1(-0.95,-1.147) 2(0,-1.147) 3(0.95,-1.147) 4(0.95,1.147) 5(-0.95,1.147)
TSOT-23-5_L2.9-W1.6-P0.95-LS2.8-BR
  rect 1.1x0.7 smd: 1(1.294,-0.951) 2(1.294,-0.001) 3(1.294,0.951) 4(-1.294,0.951) 5(-1.294,-0.949)
TYPE-C-SMD_20009-UCAF001-X
  oval 1.1x2 hole 0.7x1.6: 1(-4.32,1.606) 2(4.32,1.606)
  oval 1.1x1.8 hole 0.7x1.4: 3(4.32,-2.574) 4(-4.32,-2.574)
  rect 0.3x1.5 smd: A1(-3.4,2.573) A4(-2.6,2.573) A5(-1.25,2.573) A6(-0.25,2.573) A7(0.25,2.573) A8(1.25,2.574) A9(2.6,2.574) A12(3.4,2.573) B1(3.1,2.573) B4(2.3,2.574) B5(1.75,2.573) B6(0.75,2.573) B7(-0.75,2.573) B8(-1.75,2.574) B9(-2.3,2.573) B12(-3.1,2.573)
wirelm-smd_esp32-s
  rect 2.999x1.001 smd: 1(-8.999,9.005) 2(-8.999,7.734) 3(-8.999,6.465) 4(-8.999,5.194) 5(-8.999,3.925) 6(-8.999,2.655) 7(-8.999,1.385) 8(-8.999,0.115) 9(-8.999,-1.155) 10(-8.999,-2.425) 11(-8.999,-3.696) 12(-8.999,-4.965) 13(-8.999,-6.236) 14(-8.999,-7.505) 25(8.999,-7.505) 26(8.999,-6.236) 27(8.999,-4.965) 28(8.999,-3.696) 29(8.999,-2.425) 30(8.999,-1.155) 31(8.999,0.115) 32(8.999,1.385) 33(8.999,2.655) 34(8.999,3.925) 35(8.999,5.194) 36(8.999,6.465) 37(8.999,7.734) 38(8.999,9.005)
  rect 1.001x2.999 smd: 15(-5.715,-9.005) 16(-4.445,-9.005) 17(-3.175,-9.005) 18(-1.905,-9.005) 19(-0.635,-9.005) 20(0.635,-9.005) 21(1.905,-9.005) 22(3.175,-9.005) 23(4.445,-9.005) 24(5.715,-9.005)
  rect 4x4 smd: 39(-1.001,1.996)

## Nets
As in the schematic.

Pads without a net: FPC20 3 4; FPC21 7 26 27 31 32; NOREF 25; NOREF#2 23; SW20 3; SW22 3; U20 5 17 18 19 20 21 22 24 26 27 32; U21 1 5; U23 7; U24 4; U25 A8 B8; U26 7 8 9 10 11 12 15; U29 5 6 7

## Via types
v1: diameter 0.61, hole 0.304, Top Layer to Bottom Layer, 106 vias
v2: diameter 0.6, hole 0.305, Top Layer to Bottom Layer, 85 vias

## Routing (per net, layer and track width the routed paths; a pad name or vN(x,y) marks a point on that pad's centre or on a via; arc(x,y) is an arc through that point)
3V3: length 151.8
  Top Layer w0.254: 51.82,14.73 50.5,13.41 47.29,13.41 46.53,14.17 R32.1 ; R25.1 7.01,1.22 7.82,2.03 7.82,3.26 R20.1
  Top Layer w0.4: 8.94,24.54 8.03,23.62 8.03,6.55 v2(8.99,5.59) ; v2(8.94,3.71) 8.54,3.31 R20.1
  Top Layer w0.6: R22.2 36.32,1.33 36.37,1.28 37.14,1.28 37.69,1.83 37.69,2.49 ; v2(38.81,7.26) 38.81,7.27 FPC21.16 ; 51.82,14.73 51.82,11.46 ; v2(37.19,3) 37.69,2.49 ; 37.69,2.49 37.94,2.73 C22.2 40.58,2.73 C29.2 C30.2 43.69,2.74 v2(44.15,2.29) v2(45.06,2.29) ; 51.26,8.13 v2(51.31,8.13) v2(51.82,8.64) FPC21.29
  Top Layer w0.8: 52.53,18.08 52.63,17.98 52.63,15.08 51.82,14.27 ; v2(5.94,29.31) v2(5.94,28.5) 5.94,27.34 R21.1 6.15,27.33 8.94,24.54 28.3,24.54 30.12,22.71 31.24,22.71 31.93,22.02 U26.16
  Top Layer w1: U26.16 37.21,22.02 38.25,23.06 38.25,25.04 39.04,25.83 U26.4 41.88,25.83 42.97,26.92 ; 45.82,27.77 45.57,27.52 ; 45.42,27.67 43.72,27.67 ; 43.72,27.67 42.97,26.92 ; 43.72,27.67 C41.2 ; 42.97,26.92 42.97,26.32 44.51,24.78 ; 44.51,24.78 44.96,24.33 44.96,22.66 45.47,22.15 49.68,22.15 50.44,21.39 50.44,19.51 51.56,18.39 52.22,18.39 52.53,18.08 ; 44.51,24.78 44.85,25.12
  Bottom Layer w0.4: v2(8.94,3.71) 8.99,3.76 v2(8.99,5.59)
  Bottom Layer w0.6: v2(44.15,2.29) v2(45.06,2.29) 45.82,2.29 46.48,2.95 46.48,7.32 47.29,8.13 v2(51.31,8.13) v2(51.82,8.64) ; v2(37.19,3) 37.19,3.56 38.81,5.18 v2(38.81,7.26)
  Bottom Layer w0.8: 8.24,29.92 C20.2 6.55,29.92 v2(5.94,29.31) v2(5.94,28.5) 5.94,28.14 ; 8.24,29.92 C21.2 10.58,29.92 R23.2 ; 8.24,29.92 8.99,29.16 8.99,25.88 U20.2
GND: length 8.2
  Top Layer w0.254: U25.1 66.97,23.07 U25.A1 ; R36.1 R35.1 48.82,14.34 v2(48.82,14.07) ; U25.B1 U25.A12 66.97,29.87 U25.2
  Top Layer w0.6: FPC21.9 31.81,8.85 v2(31.8,8.84)
  vias: v1(0.95,28.29) v1(0.95,6.29) v1(0.95,2.29) v1(2.95,28.29) v1(2.95,4.29) v1(2.95,2.29) v1(4.95,30.29) v1(4.95,28.29) v1(4.95,4.29) v1(4.95,2.29) v1(6.95,28.29) v1(6.95,22.29) v1(6.95,20.29) v1(6.95,18.29) v1(6.95,16.29) v1(6.95,14.29) v1(6.95,12.29) v1(6.95,10.29) v1(6.95,2.29) v1(8.95,22.29) v1(8.95,20.29) v1(8.95,18.29) v1(8.95,16.29) v1(8.95,14.29) v1(8.95,12.29) v1(10.95,22.29) v1(10.95,20.29) v1(10.95,18.29) v1(10.95,16.29) v1(10.95,14.29) v1(10.95,10.29) v1(10.95,2.29) v1(12.95,22.29) v1(12.95,14.29) v1(12.95,10.29) v1(12.95,2.29) v1(14.95,22.29) v1(14.95,14.29) v1(14.95,10.29) v1(14.95,2.29) v1(16.95,22.29) v1(16.95,20.29) v1(16.95,14.29) v1(16.95,2.29) v1(18.95,10.29) v1(18.95,2.29) v1(20.95,18.29) v1(20.95,12.29) v1(20.95,2.29) v1(22.95,2.29) v1(24.95,2.29) v1(26.95,6.29) v1(26.95,2.29) v1(28.95,2.29) v1(30.95,20.29) v1(30.95,16.29) v1(30.95,8.29) v1(30.95,2.29) v1(32.95,2.29) v1(38.95,28.29) v1(38.95,22.29) v1(38.95,16.29) v1(40.95,18.29) v1(42.95,18.29) v1(44.95,26.29) v1(44.95,8.29) v1(46.95,30.29) v1(46.95,28.29) v1(46.95,26.29) v1(48.95,26.29) v1(48.95,6.29) v1(50.95,6.29) v1(51.16,22.4) v1(52.95,20.29) v1(52.95,8.29) v1(52.95,6.29) v1(54,20.27) v1(54,18.64) v1(54.95,14.29) v1(54.95,12.29) v1(56.95,28.29) v1(58.95,28.29) v1(58.95,6.29) v1(58.95,4.29) v1(62.95,14.29) v1(62.95,12.29) v1(62.95,10.29) v1(66.95,2.29) v1(68.95,4.29) v1(68.95,2.29) v1(70.95,28.29) v1(70.95,26.29) v1(70.95,24.29) v1(70.95,18.29) v1(70.95,14.29) v1(70.95,4.29) v1(72.95,28.29) v1(72.95,26.29) v1(72.95,24.29) v1(72.95,14.29) v1(72.95,12.29) v1(72.95,10.29) v1(72.95,8.29) v1(72.95,6.29) v1(72.95,4.29) v2(14.43,31.7) v2(14.72,17.87) v2(15.37,31.7) v2(16.37,31.7) v2(17.44,31.7) v2(28.24,25.45) v2(30.68,24.38) v2(31.65,24.38) v2(34.39,2.29) v2(37.64,30.99) v2(38.94,30.99) v2(49.89,18.49) v2(50.39,1.12) v2(51.39,1.12) v2(62.05,22) v2(62.72,22) v2(66.34,31.09)
VBAT: length 40.4
  Top Layer w0.254: 55.27,29.92 v2(55.32,29.97)
  Top Layer w0.8: 65.75,15.19 64.97,15.19 64.97,15.24 64.57,15.64 C33.2 62.8,15.64 ; C34.2 62.8,15.64 ; 62.8,15.64 62.79,15.65 61.06,15.65 61.06,14.83 60.2,13.97 56.49,13.97 55.9,14.56 FPC20.2
  Top Layer w2: FPC20.2 55.88,17.55 55.88,23.01 55.27,23.62 v2(55.27,27.28) v2(55.27,28.24) v2(55.27,29.01) 55.27,29.4
  Bottom Layer w0.6: R39.2 63.05,27.89 60.71,27.89 60.02,28.58 Q1.3
  Bottom Layer w2: v2(55.27,27.28) v2(55.27,28.24) v2(55.27,29.01) 55.27,29.92 v2(55.32,29.97) 56.44,31.09 59.24,31.09
  vias: v2(54.66,29.46) v2(54.66,28.65) v2(54.66,27.74) v2(55.88,29.46) v2(55.93,28.6) v2(55.98,27.69)
VBAT_OUT: length 83.2
  Top Layer w0.254: v2(29.41,18.85) 29.41,18.86 29.4,18.87 ; v2(26.82,26.16) 26.77,26.16 26.4,26.53 26.4,27.98
  Top Layer w0.3: 48.26,29.82 49.07,29.82 49.22,29.67 49.22,28.35 49.94,27.64
  Top Layer w0.5: U21.4 26.21,20.89 26.21,19.4 21.45,19.4 21.18,19.66 21.18,20.91 U21.8 ; C25.2 C26.2
  Top Layer w0.7: C25.2 27.4,18.87 27.38,18.85 26.76,18.85 26.21,19.4
  Top Layer w0.8: 42.16,20.32 v2(41.1,20.32) 35.05,20.32 33.6,18.87 C25.2
  Top Layer w1: C40.2 50.2,28 ; 50.2,28 49.94,27.74 ; 50.2,28 50.2,27.47 v2(51.31,26.37) v2(51.31,25.68) v2(51.31,24.94) ; 49.17,27.64 48.21,27.64 ; 49.43,27.64 49.94,27.64
  Bottom Layer w0.254: v2(29.41,18.85) 28.96,19.3 28.96,25.81 28.6,26.16 v2(26.82,26.16)
  Bottom Layer w0.5: 57.56,25.76 Q1.8
  Bottom Layer w0.8: 58.12,22.1 57.38,22.1 Q21.1 ; 40.74,20.32 v2(41.1,20.32) v2(41.93,20.32) 47.5,20.32 51.31,24.13
  Bottom Layer w1: Q21.1 53.32,22.73 51.92,24.13 51.31,24.13 v2(51.31,24.94) v2(51.31,25.68) v2(51.31,26.37) ; Q1.5 63.13,25.68 R38.2
  Bottom Layer w2: 58.88,24.54 Q1.6 ; Q1.6 Q1.7 Q1.8 57.48,22.83 Q21.1 58.65,22.73 ; Q1.6 Q1.5 ; 59.23,24.59 59.23,22.66
VBUS: length 31.9
  Top Layer w0.4: U25.B4 67.85,28.77 v2(68.33,28.3) ; 66.96,24.13 67.82,24.13 68.33,24.64 v2(68.33,24.69)
  Top Layer w0.6: 66.76,24.03 65.89,24.03 65.58,23.72 65.58,21.64 65.28,21.34 64.77,20.83 63.04,20.83 62.7,20.48 R28.1
  Top Layer w0.8: 68.45,15.6 69.9,15.6 C31.2 C32.1 72.55,15.56 73,16 73,20.52 72.64,20.88 65.73,20.88 65.28,21.34
  Bottom Layer w0.4: v2(68.33,24.69) v2(68.33,28.3)
VCC_IN: length 27.1
  Bottom Layer w2: 67.97,13.87 67.46,13.36 66.95,13.36 ; Q21.8 58.65,17.2 59.13,16.71 L20.1 60.66,14.54 60.66,17.07 60.53,17.2 ; C36.2 67.09,19.47 66.75,19.81 61.47,19.81 60.53,18.87 60.53,17.2 ; 60.53,17.2 Q21.6 ; 67.04,17.51 67.97,16.58 ; 67.87,16.58 67.87,13.87
(no net):
  vias: v1(68.95,8.29)
BTN: length 19.3
  Top Layer w0.254: 3.87,6.22 5.66,6.22 5.94,5.94 C23.2 7.72,4.87 R20.2 18.53,4.82 v2(18.85,5.13)
  Bottom Layer w0.254: U20.29 19.25,7.75 19.25,5.54 v2(18.85,5.13)
CLK: length 21
  Top Layer w0.254: v2(42.47,13.26) 42.52,13.21 44.4,13.21 44.81,12.79 FPC21.22
  Bottom Layer w0.254: v2(42.47,13.26) 28.96,13.26 28.14,12.45 25.74,12.45 U20.23
DI: length 28.2
  Top Layer w0.254: v2(42.42,14.02) 44.65,14.02 45.81,12.86 FPC21.23
  Bottom Layer w0.254: U20.16 25.74,21.29 27.69,21.29 28.24,20.73 28.24,15.19 29.41,14.02 v2(42.42,14.02)
DTR: length 5
  Top Layer w0.254: Q24.2 32.67,26.12 R43.2 33.16,25.83 U26.13
EN: length 25
  Top Layer w0.254: Q25.3 28.77,30.53 14.33,30.53 v2(13.66,29.87)
  Bottom Layer w0.254: 12.39,29.88 11.62,29.88 11.48,30.02 11.48,31.14 11.24,31.39 R23.1 ; 12.39,29.88 12.39,29.87 10.83,28.3 ; 12.39,29.88 13.65,29.88 v2(13.66,29.87) ; v2(10.82,28.35) 10.83,28.34 10.83,28.3 ; 10.83,28.3 10.25,27.72 10.25,25.86
IN1: length 35.2
  Top Layer w0.254: U21.2 28.8,20.94 28.8,22.56 27.69,23.67 20.17,23.67 18.8,22.3 18.8,14.02 17.78,13 11.07,13 v2(8.89,10.82)
  Bottom Layer w0.254: U20.37 8.89,7.96 v2(8.89,10.82)
IN2: length 32.2
  Top Layer w0.254: v2(10.26,10.82) 11.99,12.55 18.14,12.55 19.3,13.72 19.3,22.1 20.42,23.22 26.87,23.22 27.53,22.56 27.53,20.94 U21.3
  Bottom Layer w0.254: v2(10.26,10.82) 10.26,7.88 10.25,7.87
IN3: length 24.2
  Top Layer w0.254: U21.6 23.72,20.94 23.72,22.45 23.42,22.76 20.68,22.76 19.76,21.84 19.76,13.36 18.44,12.04 15.24,12.04 v2(14.02,10.82)
  Bottom Layer w0.254: v2(14.02,10.82) 14.02,7.9 U20.33
IN4: length 19.5
  Top Layer w0.254: 22.45,21.32 22.45,22 22.1,22.35 21.03,22.35 20.22,21.54 20.22,13 18.75,11.53 17.27,11.53 v2(16.56,10.82)
  Bottom Layer w0.254: 16.6,7.87 16.56,7.9 v2(16.56,10.82)
IO0: length 23.5
  Top Layer w0.254: v2(27.79,26.87) Q24.3
  Bottom Layer w0.254: v2(27.79,26.87) 26.06,26.87 25.3,26.11 25.3,24.28 24.84,23.83 24.28,23.83 23.62,23.16 23.62,10.41 24.18,9.86 24.18,7.9 U20.25
LAT: length 25.4
  Top Layer w0.254: v2(33.17,16.36) 33.17,14.17 32,13 31.09,13 30.81,12.73 FPC21.8
  Bottom Layer w0.254: U20.14 25.84,27.48 30.02,27.48 33.17,24.33 33.17,23.42 ; 33.17,23.42 v2(33.17,16.36) ; 33.17,23.42 33.12,23.47
LED: length 22.1
  Top Layer w0.254: v2(17.17,4.22) 10.36,4.22 9.8,3.66 9.8,2.39 7.87,0.46 2.45,0.46 LED22.1
  Bottom Layer w0.254: 17.87,7.87 17.88,7.85 17.88,4.93 v2(17.17,4.22)
M_A+: length 3.5
  Top Layer w0.254: FPC21.3 25.81,13.11 26.31,13.61 26.31,14.74
M_A-: length 6.3
  Top Layer w0.254: FPC21.4 26.81,12.69 27.53,13.41 29.67,13.41 30.07,13.82 30.07,15.17 U21.16
M_B+: length 5.9
  Top Layer w0.254: FPC21.1 23.82,11.47 23.82,13.16 23.42,13.56 21.69,13.56 21.23,14.02 21.18,14.02 21.18,15.17 U21.9
M_B-: length 2.7
  Top Layer w0.254: U21.12 24.98,13.45 24.84,13.31 24.84,12.5
PHE: length 15.5
  Top Layer w0.254: v2(47.4,15.65) 48.16,16.41 R35.2 47.34,17.32 46.74,17.32 46.43,17.63 46.46,17.65 U29.2 ; FPC21.28 50.81,12.63 50.5,12.95 46.69,12.95 45.52,14.12 v2(45.52,15.09)
  Bottom Layer w0.254: v2(47.4,15.65) 47.35,15.7 46.74,15.09 v2(45.52,15.09)
PHINT: length 48.2
  Top Layer w0.254: v2(45.47,16.41) 45.47,16.41 R32.2 46.53,16.56 45.92,17.17 45.57,17.17 45.19,17.55 U29.1
  Bottom Layer w0.254: v2(45.47,16.41) 41.91,16.41 39.22,19.1 37.9,19.1 37.13,19.86 37.13,26.06 31.9,31.29 18.85,31.29 15.54,27.99 15.44,27.99 15.33,27.88 15.33,25.86
POWER_ADC: length 15
  Top Layer w0.254: R27.1 26.39,29.49 R29.2 24.51,29.43 22.64,29.43 22.61,29.46 v2(15.9,29.46)
  Bottom Layer w0.254: U20.6 14.06,27.72 15.8,29.46 v2(15.9,29.46)
RTS: length 14.7
  Top Layer w0.254: U26.14 36.14,24.56 36.78,25.2 36.78,31.39 36.32,31.85 33.58,31.85 32.87,31.14 R40.2 32.57,31.23 Q25.2
RXD: length 56.1
  Top Layer w0.254: U26.2 42.17,23.29 42.61,23.72 42.99,23.72 43.26,23.45 43.26,19.72 44.06,18.91 44.06,15.34 v2(43.84,15.12)
  Bottom Layer w0.254: v2(43.84,15.12) 44.06,14.89 44.06,9.87 42.88,8.69 42.75,8.69 42.53,8.46 35.72,8.46 34.98,7.72 34.98,5.48 33.89,4.39 18.91,4.39 18.14,3.62 13.51,3.62 12.36,4.78 12.36,5.5 12.79,5.94 12.79,7.87
STB1: length 27.1
  Top Layer w0.254: v2(33.88,15.8) 33.88,11.52 FPC21.11
  Bottom Layer w0.254: 22.95,25.86 22.96,25.88 22.96,27.43 23.47,27.94 30.23,27.94 33.63,24.54 33.63,17.17 33.93,16.87 33.93,15.85 v2(33.88,15.8)
STB2: length 29.6
  Top Layer w0.254: v2(34.85,15.7) 34.81,15.66 FPC21.12
  Bottom Layer w0.254: U20.12 21.59,25.95 21.59,27.38 22.61,28.4 30.43,28.4 34.14,24.69 34.14,17.58 34.85,16.87 v2(34.85,15.7)
STB3: length 32.1
  Top Layer w0.254: FPC21.13 35.86,11.5 v2(35.86,15.7)
  Bottom Layer w0.254: 20.41,25.86 20.47,25.93 20.47,27.69 21.64,28.85 30.73,28.85 34.65,24.94 34.65,18.08 35.86,16.87 v2(35.86,15.7)
STB4: length 38.1
  Top Layer w0.254: v2(39.83,15.7) 39.81,15.69 FPC21.17
  Bottom Layer w0.254: v2(39.83,15.7) 39.83,16.36 38.71,17.48 37.08,17.48 35.71,18.85 35.71,25.4 31.34,29.77 20.52,29.77 19.15,28.4 19.15,25.88 U20.10
STB5: length 40.4
  Top Layer w0.254: v2(40.79,15.7) 40.81,15.67 FPC21.18
  Bottom Layer w0.254: v2(40.79,15.7) 40.79,16.05 38.81,18.03 37.39,18.03 36.22,19.2 36.22,25.7 31.6,30.33 20.07,30.33 17.88,28.14 17.88,25.88 17.87,25.86
STB6: length 42.9
  Top Layer w0.254: FPC21.19 41.81,15.69 v2(41.81,15.7)
  Bottom Layer w0.254: v2(41.81,15.7) 41.81,15.75 38.96,18.59 37.59,18.59 36.68,19.51 36.68,25.91 31.75,30.84 19.35,30.84 16.56,28.04 16.56,25.9 16.6,25.86
THER: length 51.5
  Top Layer w0.254: v2(36.83,7.26) 36.81,7.28 FPC21.14 36.81,15.66 v2(36.78,15.7) ; R22.1 35.71,3.35 v2(36.53,4.17) ; v2(12.9,28.7) v2(20.32,28.7)
  Bottom Layer w0.254: v2(12.9,28.7) 12.29,28.7 11.52,27.93 11.52,25.86 ; v2(20.32,28.7) 20.93,29.31 31.04,29.31 35.15,25.2 35.15,18.59 36.78,16.97 v2(36.78,15.7) ; v2(36.53,4.17) 36.83,4.47 v2(36.83,7.26)
TXD: length 58.3
  Top Layer w0.254: v2(44.69,15.12) 44.47,15.34 44.47,19.08 43.66,19.89 43.66,23.62 43.16,24.13 42.61,24.13 42.17,24.56 U26.3
  Bottom Layer w0.254: v2(44.69,15.12) 44.47,14.89 44.47,9.7 43.04,8.28 42.92,8.28 42.69,8.05 35.89,8.05 35.38,7.55 35.38,5.31 34.06,3.99 19.08,3.99 18.3,3.22 13.13,3.22 11.95,4.4 11.95,5.5 11.52,5.94 11.52,7.87
UD+: length 42.2
  Top Layer w0.254: U25.A6 65.63,26.22 65.33,26.52 65.33,26.92 65.63,27.23 66.91,27.23 U25.B6 68.1,27.22 68.15,27.17 68.53,27.17 69.39,28.03 69.39,31.19 68.83,31.75 43.54,31.75 42.82,31.04 42.82,28.37 41.78,27.33 40.98,27.33 40.87,27.22 U26.5
UD-: length 42.1
  Top Layer w0.254: 68.59,26.76 68.88,26.47 68.88,25.96 68.64,25.72 U25.B7 ; 68.59,26.76 68.15,26.76 68.1,26.72 U25.A7 ; 68.59,26.76 68.7,26.76 69.8,27.86 69.8,31.36 69,32.16 43.37,32.16 42.42,31.21 42.42,28.75 42.01,28.35 40.9,28.35 U26.6
VH: length 61.2
  Top Layer w1.8: 47.29,7.32 47.29,11.58 ; 28.3,7.57 28.3,11.58
  Top Layer w2: 28.3,7.57 28.3,7.42 28.35,7.42 28.45,7.32 28.45,7.01 29.77,5.69 45.11,5.69 46.74,4.06 ; 47.29,7.32 46.74,6.76 46.74,4.06 ; 61.62,2.03 v2(60.35,2.03) v2(59.32,2.03) v2(58.29,2.03) v2(57.25,2.03) v2(56.13,2.03) v2(54.95,2.03) 53.19,2.03 52.02,3.2 47.6,3.2 46.74,4.06
  Bottom Layer w0.5: R30.2 62.38,5.79
  Bottom Layer w2: 63.81,3.69 63.81,2.19 63.65,2.03 v2(61.52,2.03) v2(60.35,2.03) v2(59.32,2.03) v2(58.29,2.03) v2(57.25,2.03) v2(56.13,2.03) 55.12,2.03 55.07,2.08 ; 63.04,3.76 61.83,4.97 D20.1
VH_EN: length 64.1
  Bottom Layer w0.254: 20.41,7.87 20.41,5.19 20.83,4.78 33.73,4.78 34.59,5.64 34.59,7.87 35.56,8.84 42.37,8.84 43.64,10.11 43.64,14.27 43.18,14.73 43.18,15.39 43.59,15.8 46.63,15.8 47.24,16.41 55.12,16.41 55.93,17.22 55.93,19.15 56.9,20.12 59.79,20.12 60.91,21.23 65.33,21.23 65.79,21.69 65.79,22.93 Q23.1
$1N47791: length 6.3
  Top Layer w0.254: U29.3 47.75,19.39 47.75,17.78 48.16,17.37 49.22,17.37 49.73,16.87 R36.2 51.53,16.41 R31.1
$1N163268: length 3.9
  Top Layer w0.254: FPC21.30 52.83,11.47 52.83,13.21 53.85,14.22 53.85,14.94
$1N171056: length 1.7
  Top Layer w0.254: R21.2 4.42,27.33 LED20.2
$1N192885: length 2.6
  Top Layer w0.254: Q25.1 31.23,29.33 32.87,27.69 R43.1
$1N192889: length 7.8
  Top Layer w0.254: Q24.1 30.82,25.92 29.97,26.77 29.97,29.77 30.48,30.28 32.01,30.28 R40.1
$1N228514: length 5.9
  Bottom Layer w0.254: Q21.4 61.47,23.01 62.62,23.01 ; Q23.3 62.62,23.01 ; 62.62,23.01 62.69,23.08 62.69,24.44 63.04,24.79 64.36,24.79 64.66,25.09 R38.1
$1N228520: length 3.5
  Bottom Layer w0.254: U23.6 66.39,6.2 R33.2 R30.1
$1N228523: length 2.3
  Bottom Layer w0.254: U23.2 65.12,14.13 64.08,15.17 R34.2
$1N228526: length 9.3
  Bottom Layer w2: D20.2 56.03,5 56.03,6.55 57.49,8.02 L20.2 63.18,8.02 63.19,8.03
$1N229607: length 3.5
  Top Layer w0.254: U22.5 68.24,17.49 68.94,18.19 69.75,18.19 70.05,18.49 70.26,18.49 70.26,19.3 R26.2
$1N229610: length 2.3
  Top Layer w0.254: LED21.1 R28.2
$1N229612: length 4.1
  Top Layer w0.254: LED21.2 68.17,19.44 68.17,18.49 67.92,18.24 66.19,18.24 65.95,17.99 U22.1
$1N230614: length 3.1
  Top Layer w0.254: U25.A5 65.65,25.22 65.33,24.89 64.2,24.89 64.01,25.09
$1N230615: length 2.8
  Top Layer w0.254: 64.26,28.41 64.3,28.45 65.38,28.45 65.61,28.22 U25.B5
$1N231307: length 1.8
  Top Layer w0.254: R25.2 4.93,1.27 LED22.2
$1N232666: length 36.5
  Top Layer w0.254: v2(70.71,7.92) 70.21,7.42 68.95,7.42 SW22.1 68.07,6.54 E20.1
  Bottom Layer w0.254: 66.24,27.08 65.53,27.79 R39.1 ; 66.24,27.08 66.24,21.74 66.75,21.23 67.46,21.23 69.39,19.3 69.39,14.48 70.71,13.16 v2(70.71,7.92) ; 66.24,27.08 66.24,30.28 65.28,31.24 61.32,31.24 Q1.4

## Copper pours and planes (outline as drawn; the poured copper is in the pictures)
GND on Top Layer: -0.56,33.02 74.12,33.02 74.12,-0.25 -0.56,-0.25
GND on Bottom Layer: -0.36,32.97 73.91,32.97 73.91,-0.25 -0.36,-0.25

## Text on the board
Top Silkscreen Layer: B+B-A+A- VH LAT | 1 2 3 | CLKDI VH   PHE V | 4 5 6 | 调试按键 | 打印头 | 关 | + | -
